# EasyEDA schematic SCH_Hall sensor array_2022-12-20.json
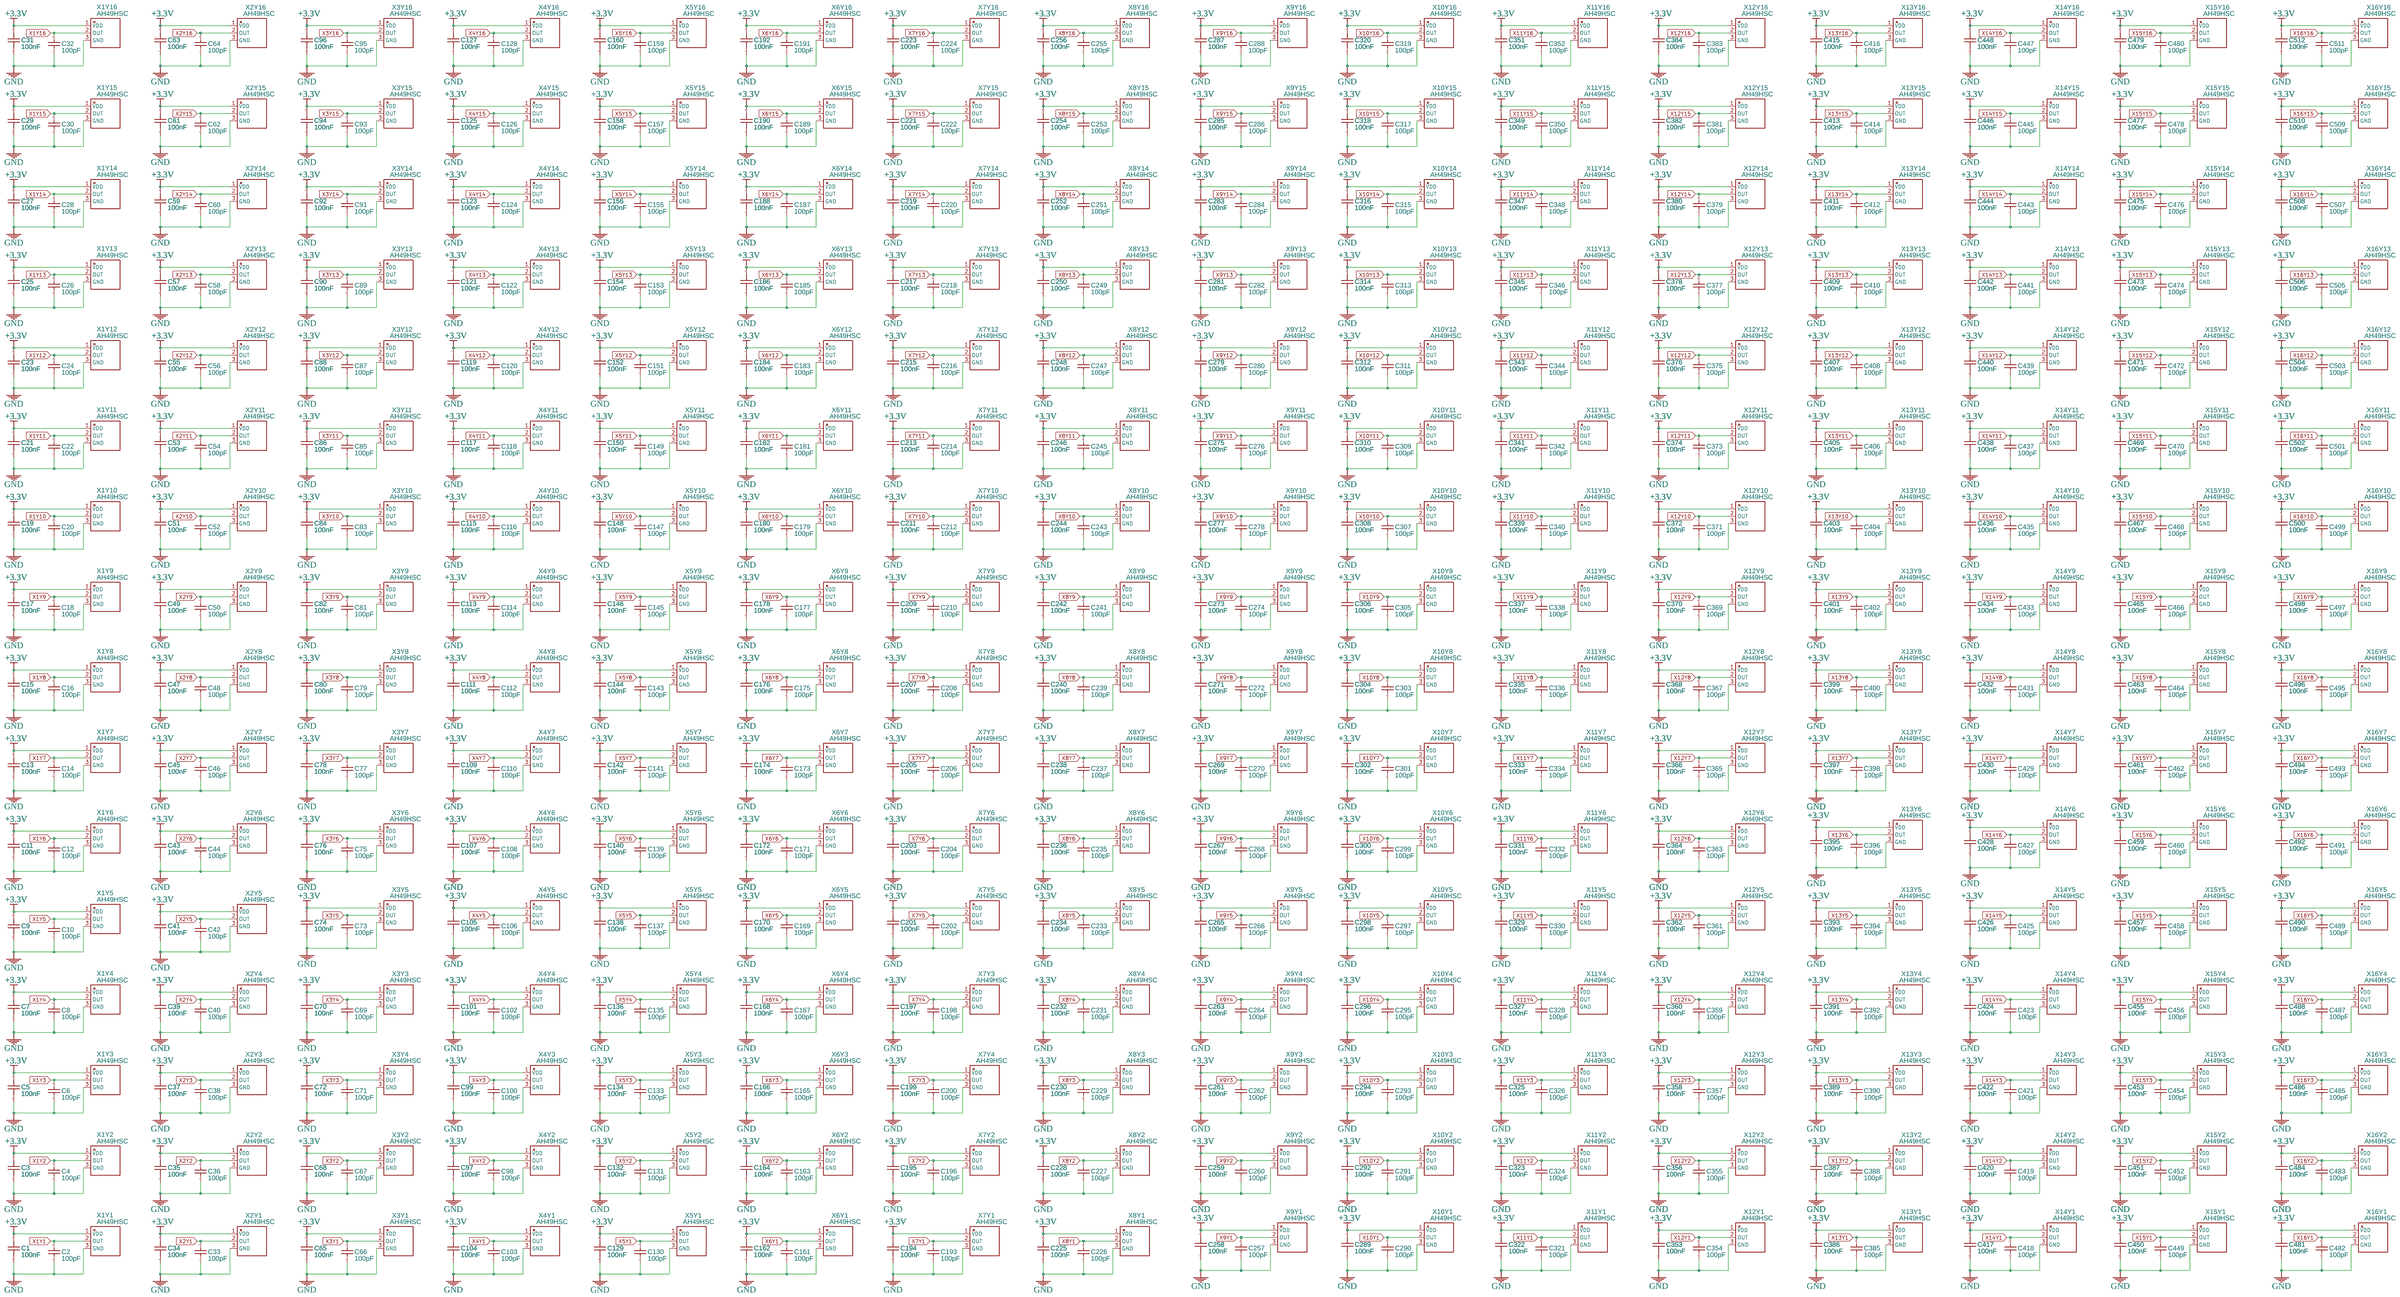
[diagram p0: schematic sheet]

## Parts
C1  100nF  [C0603]
C2  100pF  [C0603]
C3  100nF  [C0603]
C4  100pF  [C0603]
C5  100nF  [C0603]
C6  100pF  [C0603]
C7  100nF  [C0603]
C8  100pF  [C0603]
C9  100nF  [C0603]
C10  100pF  [C0603]
C11  100nF  [C0603]
C12  100pF  [C0603]
C13  100nF  [C0603]
C14  100pF  [C0603]
C15  100nF  [C0603]
C16  100pF  [C0603]
C17  100nF  [C0603]
C18  100pF  [C0603]
C19  100nF  [C0603]
C20  100pF  [C0603]
C21  100nF  [C0603]
C22  100pF  [C0603]
C23  100nF  [C0603]
C24  100pF  [C0603]
C25  100nF  [C0603]
C26  100pF  [C0603]
C27  100nF  [C0603]
C28  100pF  [C0603]
C29  100nF  [C0603]
C30  100pF  [C0603]
C31  100nF  [C0603]
C32  100pF  [C0603]
C33  100pF  [C0603]
C34  100nF  [C0603]
C35  100nF  [C0603]
C36  100pF  [C0603]
C37  100nF  [C0603]
C38  100pF  [C0603]
C39  100nF  [C0603]
C40  100pF  [C0603]
C41  100nF  [C0603]
C42  100pF  [C0603]
C43  100nF  [C0603]
C44  100pF  [C0603]
C45  100nF  [C0603]
C46  100pF  [C0603]
C47  100nF  [C0603]
C48  100pF  [C0603]
C49  100nF  [C0603]
C50  100pF  [C0603]
C51  100nF  [C0603]
C52  100pF  [C0603]
C53  100nF  [C0603]
C54  100pF  [C0603]
C55  100nF  [C0603]
C56  100pF  [C0603]
C57  100nF  [C0603]
C58  100pF  [C0603]
C59  100nF  [C0603]
C60  100pF  [C0603]
C61  100nF  [C0603]
C62  100pF  [C0603]
C63  100nF  [C0603]
C64  100pF  [C0603]
C65  100nF  [C0603]
C66  100pF  [C0603]
C67  100pF  [C0603]
C68  100nF  [C0603]
C69  100pF  [C0603]
C70  100nF  [C0603]
C71  100pF  [C0603]
C72  100nF  [C0603]
C73  100pF  [C0603]
C74  100nF  [C0603]
C75  100pF  [C0603]
C76  100nF  [C0603]
C77  100pF  [C0603]
C78  100nF  [C0603]
C79  100pF  [C0603]
C80  100nF  [C0603]
C81  100pF  [C0603]
C82  100nF  [C0603]
C83  100pF  [C0603]
C84  100nF  [C0603]
C85  100pF  [C0603]
C86  100nF  [C0603]
C87  100pF  [C0603]
C88  100nF  [C0603]
C89  100pF  [C0603]
C90  100nF  [C0603]
C91  100pF  [C0603]
C92  100nF  [C0603]
C93  100pF  [C0603]
C94  100nF  [C0603]
C95  100pF  [C0603]
C96  100nF  [C0603]
C97  100nF  [C0603]
C98  100pF  [C0603]
C99  100nF  [C0603]
C100  100pF  [C0603]
C101  100nF  [C0603]
C102  100pF  [C0603]
C103  100pF  [C0603]
C104  100nF  [C0603]
C105  100nF  [C0603]
C106  100pF  [C0603]
C107  100nF  [C0603]
C108  100pF  [C0603]
C109  100nF  [C0603]
C110  100pF  [C0603]
C111  100nF  [C0603]
C112  100pF  [C0603]
C113  100nF  [C0603]
C114  100pF  [C0603]
C115  100nF  [C0603]
C116  100pF  [C0603]
C117  100nF  [C0603]
C118  100pF  [C0603]
C119  100nF  [C0603]
C120  100pF  [C0603]
C121  100nF  [C0603]
C122  100pF  [C0603]
C123  100nF  [C0603]
C124  100pF  [C0603]
C125  100nF  [C0603]
C126  100pF  [C0603]
C127  100nF  [C0603]
C128  100pF  [C0603]
C129  100nF  [C0603]
C130  100pF  [C0603]
C131  100pF  [C0603]
C132  100nF  [C0603]
C133  100pF  [C0603]
C134  100nF  [C0603]
C135  100pF  [C0603]
C136  100nF  [C0603]
C137  100pF  [C0603]
C138  100nF  [C0603]
C139  100pF  [C0603]
C140  100nF  [C0603]
C141  100pF  [C0603]
C142  100nF  [C0603]
C143  100pF  [C0603]
C144  100nF  [C0603]
C145  100pF  [C0603]
C146  100nF  [C0603]
C147  100pF  [C0603]
C148  100nF  [C0603]
C149  100pF  [C0603]
C150  100nF  [C0603]
C151  100pF  [C0603]
C152  100nF  [C0603]
C153  100pF  [C0603]
C154  100nF  [C0603]
C155  100pF  [C0603]
C156  100nF  [C0603]
C157  100pF  [C0603]
C158  100nF  [C0603]
C159  100pF  [C0603]
C160  100nF  [C0603]
C161  100pF  [C0603]
C162  100nF  [C0603]
C163  100pF  [C0603]
C164  100nF  [C0603]
C165  100pF  [C0603]
C166  100nF  [C0603]
C167  100pF  [C0603]
C168  100nF  [C0603]
C169  100pF  [C0603]
C170  100nF  [C0603]
C171  100pF  [C0603]
C172  100nF  [C0603]
C173  100pF  [C0603]
C174  100nF  [C0603]
C175  100pF  [C0603]
C176  100nF  [C0603]
C177  100pF  [C0603]
C178  100nF  [C0603]
C179  100pF  [C0603]
C180  100nF  [C0603]
C181  100pF  [C0603]
C182  100nF  [C0603]
C183  100pF  [C0603]
C184  100nF  [C0603]
C185  100pF  [C0603]
C186  100nF  [C0603]
C187  100pF  [C0603]
C188  100nF  [C0603]
C189  100pF  [C0603]
C190  100nF  [C0603]
C191  100pF  [C0603]
C192  100nF  [C0603]
C193  100pF  [C0603]
C194  100nF  [C0603]
C195  100nF  [C0603]
C196  100pF  [C0603]
C197  100nF  [C0603]
C198  100pF  [C0603]
C199  100nF  [C0603]
C200  100pF  [C0603]
C201  100nF  [C0603]
C202  100pF  [C0603]
C203  100nF  [C0603]
C204  100pF  [C0603]
C205  100nF  [C0603]
C206  100pF  [C0603]
C207  100nF  [C0603]
C208  100pF  [C0603]
C209  100nF  [C0603]
C210  100pF  [C0603]
C211  100nF  [C0603]
C212  100pF  [C0603]
C213  100nF  [C0603]
C214  100pF  [C0603]
C215  100nF  [C0603]
C216  100pF  [C0603]
C217  100nF  [C0603]
C218  100pF  [C0603]
C219  100nF  [C0603]
C220  100pF  [C0603]
C221  100nF  [C0603]
C222  100pF  [C0603]
C223  100nF  [C0603]
C224  100pF  [C0603]
C225  100nF  [C0603]
C226  100pF  [C0603]
C227  100pF  [C0603]
C228  100nF  [C0603]
C229  100pF  [C0603]
C230  100nF  [C0603]
C231  100pF  [C0603]
C232  100nF  [C0603]
C233  100pF  [C0603]
C234  100nF  [C0603]
C235  100pF  [C0603]
C236  100nF  [C0603]
C237  100pF  [C0603]
C238  100nF  [C0603]
C239  100pF  [C0603]
C240  100nF  [C0603]
C241  100pF  [C0603]
C242  100nF  [C0603]
C243  100pF  [C0603]
C244  100nF  [C0603]
C245  100pF  [C0603]
C246  100nF  [C0603]
C247  100pF  [C0603]
C248  100nF  [C0603]
C249  100pF  [C0603]
C250  100nF  [C0603]
C251  100pF  [C0603]
C252  100nF  [C0603]
C253  100pF  [C0603]
C254  100nF  [C0603]
C255  100pF  [C0603]
C256  100nF  [C0603]
C257  100pF  [C0603]
C258  100nF  [C0603]
C259  100nF  [C0603]
C260  100pF  [C0603]
C261  100nF  [C0603]
C262  100pF  [C0603]
C263  100nF  [C0603]
C264  100pF  [C0603]
C265  100nF  [C0603]
C266  100pF  [C0603]
C267  100nF  [C0603]
C268  100pF  [C0603]
C269  100nF  [C0603]
C270  100pF  [C0603]
C271  100nF  [C0603]
C272  100pF  [C0603]
C273  100nF  [C0603]
C274  100pF  [C0603]
C275  100nF  [C0603]
C276  100pF  [C0603]
C277  100nF  [C0603]
C278  100pF  [C0603]
C279  100nF  [C0603]
C280  100pF  [C0603]
C281  100nF  [C0603]
C282  100pF  [C0603]
C283  100nF  [C0603]
C284  100pF  [C0603]
C285  100nF  [C0603]
C286  100pF  [C0603]
C287  100nF  [C0603]
C288  100pF  [C0603]
C289  100nF  [C0603]
C290  100pF  [C0603]
C291  100pF  [C0603]
C292  100nF  [C0603]
C293  100pF  [C0603]
C294  100nF  [C0603]
C295  100pF  [C0603]
C296  100nF  [C0603]
C297  100pF  [C0603]
C298  100nF  [C0603]
C299  100pF  [C0603]
C300  100nF  [C0603]
C301  100pF  [C0603]
C302  100nF  [C0603]
C303  100pF  [C0603]
C304  100nF  [C0603]
C305  100pF  [C0603]
C306  100nF  [C0603]
C307  100pF  [C0603]
C308  100nF  [C0603]
C309  100pF  [C0603]
C310  100nF  [C0603]
C311  100pF  [C0603]
C312  100nF  [C0603]
C313  100pF  [C0603]
C314  100nF  [C0603]
C315  100pF  [C0603]
C316  100nF  [C0603]
C317  100pF  [C0603]
C318  100nF  [C0603]
C319  100pF  [C0603]
C320  100nF  [C0603]
C321  100pF  [C0603]
C322  100nF  [C0603]
C323  100nF  [C0603]
C324  100pF  [C0603]
C325  100nF  [C0603]
C326  100pF  [C0603]
C327  100nF  [C0603]
C328  100pF  [C0603]
C329  100nF  [C0603]
C330  100pF  [C0603]
C331  100nF  [C0603]
C332  100pF  [C0603]
C333  100nF  [C0603]
C334  100pF  [C0603]
C335  100nF  [C0603]
C336  100pF  [C0603]
C337  100nF  [C0603]
C338  100pF  [C0603]
C339  100nF  [C0603]
C340  100pF  [C0603]
C341  100nF  [C0603]
C342  100pF  [C0603]
C343  100nF  [C0603]
C344  100pF  [C0603]
C345  100nF  [C0603]
C346  100pF  [C0603]
C347  100nF  [C0603]
C348  100pF  [C0603]
C349  100nF  [C0603]
C350  100pF  [C0603]
C351  100nF  [C0603]
C352  100pF  [C0603]
C353  100nF  [C0603]
C354  100pF  [C0603]
C355  100pF  [C0603]
C356  100nF  [C0603]
C357  100pF  [C0603]
C358  100nF  [C0603]
C359  100pF  [C0603]
C360  100nF  [C0603]
C361  100pF  [C0603]
C362  100nF  [C0603]
C363  100pF  [C0603]
C364  100nF  [C0603]
C365  100pF  [C0603]
C366  100nF  [C0603]
C367  100pF  [C0603]
C368  100nF  [C0603]
C369  100pF  [C0603]
C370  100nF  [C0603]
C371  100pF  [C0603]
C372  100nF  [C0603]
C373  100pF  [C0603]
C374  100nF  [C0603]
C375  100pF  [C0603]
C376  100nF  [C0603]
C377  100pF  [C0603]
C378  100nF  [C0603]
C379  100pF  [C0603]
C380  100nF  [C0603]
C381  100pF  [C0603]
C382  100nF  [C0603]
C383  100pF  [C0603]
C384  100nF  [C0603]
C385  100pF  [C0603]
C386  100nF  [C0603]
C387  100nF  [C0603]
C388  100pF  [C0603]
C389  100nF  [C0603]
C390  100pF  [C0603]
C391  100nF  [C0603]
C392  100pF  [C0603]
C393  100nF  [C0603]
C394  100pF  [C0603]
C395  100nF  [C0603]
C396  100pF  [C0603]
C397  100nF  [C0603]
C398  100pF  [C0603]
C399  100nF  [C0603]
C400  100pF  [C0603]
C401  100nF  [C0603]
C402  100pF  [C0603]
C403  100nF  [C0603]
C404  100pF  [C0603]
C405  100nF  [C0603]
C406  100pF  [C0603]
C407  100nF  [C0603]
C408  100pF  [C0603]
C409  100nF  [C0603]
C410  100pF  [C0603]
C411  100nF  [C0603]
C412  100pF  [C0603]
C413  100nF  [C0603]
C414  100pF  [C0603]
C415  100nF  [C0603]
C416  100pF  [C0603]
C417  100nF  [C0603]
C418  100pF  [C0603]
C419  100pF  [C0603]
C420  100nF  [C0603]
C421  100pF  [C0603]
C422  100nF  [C0603]
C423  100pF  [C0603]
C424  100nF  [C0603]
C425  100pF  [C0603]
C426  100nF  [C0603]
C427  100pF  [C0603]
C428  100nF  [C0603]
C429  100pF  [C0603]
C430  100nF  [C0603]
C431  100pF  [C0603]
C432  100nF  [C0603]
C433  100pF  [C0603]
C434  100nF  [C0603]
C435  100pF  [C0603]
C436  100nF  [C0603]
C437  100pF  [C0603]
C438  100nF  [C0603]
C439  100pF  [C0603]
C440  100nF  [C0603]
C441  100pF  [C0603]
C442  100nF  [C0603]
C443  100pF  [C0603]
C444  100nF  [C0603]
C445  100pF  [C0603]
C446  100nF  [C0603]
C447  100pF  [C0603]
C448  100nF  [C0603]
C449  100pF  [C0603]
C450  100nF  [C0603]
C451  100nF  [C0603]
C452  100pF  [C0603]
C453  100nF  [C0603]
C454  100pF  [C0603]
C455  100nF  [C0603]
C456  100pF  [C0603]
C457  100nF  [C0603]
C458  100pF  [C0603]
C459  100nF  [C0603]
C460  100pF  [C0603]
C461  100nF  [C0603]
C462  100pF  [C0603]
C463  100nF  [C0603]
C464  100pF  [C0603]
C465  100nF  [C0603]
C466  100pF  [C0603]
C467  100nF  [C0603]
C468  100pF  [C0603]
C469  100nF  [C0603]
C470  100pF  [C0603]
C471  100nF  [C0603]
C472  100pF  [C0603]
C473  100nF  [C0603]
C474  100pF  [C0603]
C475  100nF  [C0603]
C476  100pF  [C0603]
C477  100nF  [C0603]
C478  100pF  [C0603]
C479  100nF  [C0603]
C480  100pF  [C0603]
C481  100nF  [C0603]
C482  100pF  [C0603]
C483  100pF  [C0603]
C484  100nF  [C0603]
C485  100pF  [C0603]
C486  100nF  [C0603]
C487  100pF  [C0603]
C488  100nF  [C0603]
C489  100pF  [C0603]
C490  100nF  [C0603]
C491  100pF  [C0603]
C492  100nF  [C0603]
C493  100pF  [C0603]
C494  100nF  [C0603]
C495  100pF  [C0603]
C496  100nF  [C0603]
C497  100pF  [C0603]
C498  100nF  [C0603]
C499  100pF  [C0603]
C500  100nF  [C0603]
C501  100pF  [C0603]
C502  100nF  [C0603]
C503  100pF  [C0603]
C504  100nF  [C0603]
C505  100pF  [C0603]
C506  100nF  [C0603]
C507  100pF  [C0603]
C508  100nF  [C0603]
C509  100pF  [C0603]
C510  100nF  [C0603]
C511  100pF  [C0603]
C512  100nF  [C0603]
X1Y1  AH49HSC  [SOT-23-3_L2.9-W1.6-P1.90-LS2.8-BR]
X1Y2  AH49HSC  [SOT-23-3_L2.9-W1.6-P1.90-LS2.8-BR]
X1Y3  AH49HSC  [SOT-23-3_L2.9-W1.6-P1.90-LS2.8-BR]
X1Y4  AH49HSC  [SOT-23-3_L2.9-W1.6-P1.90-LS2.8-BR]
X1Y5  AH49HSC  [SOT-23-3_L2.9-W1.6-P1.90-LS2.8-BR]
X1Y6  AH49HSC  [SOT-23-3_L2.9-W1.6-P1.90-LS2.8-BR]
X1Y7  AH49HSC  [SOT-23-3_L2.9-W1.6-P1.90-LS2.8-BR]
X1Y8  AH49HSC  [SOT-23-3_L2.9-W1.6-P1.90-LS2.8-BR]
X1Y9  AH49HSC  [SOT-23-3_L2.9-W1.6-P1.90-LS2.8-BR]
X1Y10  AH49HSC  [SOT-23-3_L2.9-W1.6-P1.90-LS2.8-BR]
X1Y11  AH49HSC  [SOT-23-3_L2.9-W1.6-P1.90-LS2.8-BR]
X1Y12  AH49HSC  [SOT-23-3_L2.9-W1.6-P1.90-LS2.8-BR]
X1Y13  AH49HSC  [SOT-23-3_L2.9-W1.6-P1.90-LS2.8-BR]
X1Y14  AH49HSC  [SOT-23-3_L2.9-W1.6-P1.90-LS2.8-BR]
X1Y15  AH49HSC  [SOT-23-3_L2.9-W1.6-P1.90-LS2.8-BR]
X1Y16  AH49HSC  [SOT-23-3_L2.9-W1.6-P1.90-LS2.8-BR]
X2Y1  AH49HSC  [SOT-23-3_L2.9-W1.6-P1.90-LS2.8-BR]
X2Y2  AH49HSC  [SOT-23-3_L2.9-W1.6-P1.90-LS2.8-BR]
X2Y3  AH49HSC  [SOT-23-3_L2.9-W1.6-P1.90-LS2.8-BR]
X2Y4  AH49HSC  [SOT-23-3_L2.9-W1.6-P1.90-LS2.8-BR]
X2Y5  AH49HSC  [SOT-23-3_L2.9-W1.6-P1.90-LS2.8-BR]
X2Y6  AH49HSC  [SOT-23-3_L2.9-W1.6-P1.90-LS2.8-BR]
X2Y7  AH49HSC  [SOT-23-3_L2.9-W1.6-P1.90-LS2.8-BR]
X2Y8  AH49HSC  [SOT-23-3_L2.9-W1.6-P1.90-LS2.8-BR]
X2Y9  AH49HSC  [SOT-23-3_L2.9-W1.6-P1.90-LS2.8-BR]
X2Y10  AH49HSC  [SOT-23-3_L2.9-W1.6-P1.90-LS2.8-BR]
X2Y11  AH49HSC  [SOT-23-3_L2.9-W1.6-P1.90-LS2.8-BR]
X2Y12  AH49HSC  [SOT-23-3_L2.9-W1.6-P1.90-LS2.8-BR]
X2Y13  AH49HSC  [SOT-23-3_L2.9-W1.6-P1.90-LS2.8-BR]
X2Y14  AH49HSC  [SOT-23-3_L2.9-W1.6-P1.90-LS2.8-BR]
X2Y15  AH49HSC  [SOT-23-3_L2.9-W1.6-P1.90-LS2.8-BR]
X2Y16  AH49HSC  [SOT-23-3_L2.9-W1.6-P1.90-LS2.8-BR]
X3Y1  AH49HSC  [SOT-23-3_L2.9-W1.6-P1.90-LS2.8-BR]
X3Y2  AH49HSC  [SOT-23-3_L2.9-W1.6-P1.90-LS2.8-BR]
X3Y3  AH49HSC  [SOT-23-3_L2.9-W1.6-P1.90-LS2.8-BR]
X3Y4  AH49HSC  [SOT-23-3_L2.9-W1.6-P1.90-LS2.8-BR]
X3Y5  AH49HSC  [SOT-23-3_L2.9-W1.6-P1.90-LS2.8-BR]
X3Y6  AH49HSC  [SOT-23-3_L2.9-W1.6-P1.90-LS2.8-BR]
X3Y7  AH49HSC  [SOT-23-3_L2.9-W1.6-P1.90-LS2.8-BR]
X3Y8  AH49HSC  [SOT-23-3_L2.9-W1.6-P1.90-LS2.8-BR]
X3Y9  AH49HSC  [SOT-23-3_L2.9-W1.6-P1.90-LS2.8-BR]
X3Y10  AH49HSC  [SOT-23-3_L2.9-W1.6-P1.90-LS2.8-BR]
X3Y11  AH49HSC  [SOT-23-3_L2.9-W1.6-P1.90-LS2.8-BR]
X3Y12  AH49HSC  [SOT-23-3_L2.9-W1.6-P1.90-LS2.8-BR]
X3Y13  AH49HSC  [SOT-23-3_L2.9-W1.6-P1.90-LS2.8-BR]
X3Y14  AH49HSC  [SOT-23-3_L2.9-W1.6-P1.90-LS2.8-BR]
X3Y15  AH49HSC  [SOT-23-3_L2.9-W1.6-P1.90-LS2.8-BR]
X3Y16  AH49HSC  [SOT-23-3_L2.9-W1.6-P1.90-LS2.8-BR]
X4Y1  AH49HSC  [SOT-23-3_L2.9-W1.6-P1.90-LS2.8-BR]
X4Y2  AH49HSC  [SOT-23-3_L2.9-W1.6-P1.90-LS2.8-BR]
X4Y3  AH49HSC  [SOT-23-3_L2.9-W1.6-P1.90-LS2.8-BR]
X4Y4  AH49HSC  [SOT-23-3_L2.9-W1.6-P1.90-LS2.8-BR]
X4Y5  AH49HSC  [SOT-23-3_L2.9-W1.6-P1.90-LS2.8-BR]
X4Y6  AH49HSC  [SOT-23-3_L2.9-W1.6-P1.90-LS2.8-BR]
X4Y7  AH49HSC  [SOT-23-3_L2.9-W1.6-P1.90-LS2.8-BR]
X4Y8  AH49HSC  [SOT-23-3_L2.9-W1.6-P1.90-LS2.8-BR]
X4Y9  AH49HSC  [SOT-23-3_L2.9-W1.6-P1.90-LS2.8-BR]
X4Y10  AH49HSC  [SOT-23-3_L2.9-W1.6-P1.90-LS2.8-BR]
X4Y11  AH49HSC  [SOT-23-3_L2.9-W1.6-P1.90-LS2.8-BR]
X4Y12  AH49HSC  [SOT-23-3_L2.9-W1.6-P1.90-LS2.8-BR]
X4Y13  AH49HSC  [SOT-23-3_L2.9-W1.6-P1.90-LS2.8-BR]
X4Y14  AH49HSC  [SOT-23-3_L2.9-W1.6-P1.90-LS2.8-BR]
X4Y15  AH49HSC  [SOT-23-3_L2.9-W1.6-P1.90-LS2.8-BR]
X4Y16  AH49HSC  [SOT-23-3_L2.9-W1.6-P1.90-LS2.8-BR]
X5Y1  AH49HSC  [SOT-23-3_L2.9-W1.6-P1.90-LS2.8-BR]
X5Y2  AH49HSC  [SOT-23-3_L2.9-W1.6-P1.90-LS2.8-BR]
X5Y3  AH49HSC  [SOT-23-3_L2.9-W1.6-P1.90-LS2.8-BR]
X5Y4  AH49HSC  [SOT-23-3_L2.9-W1.6-P1.90-LS2.8-BR]
X5Y5  AH49HSC  [SOT-23-3_L2.9-W1.6-P1.90-LS2.8-BR]
X5Y6  AH49HSC  [SOT-23-3_L2.9-W1.6-P1.90-LS2.8-BR]
X5Y7  AH49HSC  [SOT-23-3_L2.9-W1.6-P1.90-LS2.8-BR]
X5Y8  AH49HSC  [SOT-23-3_L2.9-W1.6-P1.90-LS2.8-BR]
X5Y9  AH49HSC  [SOT-23-3_L2.9-W1.6-P1.90-LS2.8-BR]
X5Y10  AH49HSC  [SOT-23-3_L2.9-W1.6-P1.90-LS2.8-BR]
X5Y11  AH49HSC  [SOT-23-3_L2.9-W1.6-P1.90-LS2.8-BR]
X5Y12  AH49HSC  [SOT-23-3_L2.9-W1.6-P1.90-LS2.8-BR]
X5Y13  AH49HSC  [SOT-23-3_L2.9-W1.6-P1.90-LS2.8-BR]
X5Y14  AH49HSC  [SOT-23-3_L2.9-W1.6-P1.90-LS2.8-BR]
X5Y15  AH49HSC  [SOT-23-3_L2.9-W1.6-P1.90-LS2.8-BR]
X5Y16  AH49HSC  [SOT-23-3_L2.9-W1.6-P1.90-LS2.8-BR]
X6Y1  AH49HSC  [SOT-23-3_L2.9-W1.6-P1.90-LS2.8-BR]
X6Y2  AH49HSC  [SOT-23-3_L2.9-W1.6-P1.90-LS2.8-BR]
X6Y3  AH49HSC  [SOT-23-3_L2.9-W1.6-P1.90-LS2.8-BR]
X6Y4  AH49HSC  [SOT-23-3_L2.9-W1.6-P1.90-LS2.8-BR]
X6Y5  AH49HSC  [SOT-23-3_L2.9-W1.6-P1.90-LS2.8-BR]
X6Y6  AH49HSC  [SOT-23-3_L2.9-W1.6-P1.90-LS2.8-BR]
X6Y7  AH49HSC  [SOT-23-3_L2.9-W1.6-P1.90-LS2.8-BR]
X6Y8  AH49HSC  [SOT-23-3_L2.9-W1.6-P1.90-LS2.8-BR]
X6Y9  AH49HSC  [SOT-23-3_L2.9-W1.6-P1.90-LS2.8-BR]
X6Y10  AH49HSC  [SOT-23-3_L2.9-W1.6-P1.90-LS2.8-BR]
X6Y11  AH49HSC  [SOT-23-3_L2.9-W1.6-P1.90-LS2.8-BR]
X6Y12  AH49HSC  [SOT-23-3_L2.9-W1.6-P1.90-LS2.8-BR]
X6Y13  AH49HSC  [SOT-23-3_L2.9-W1.6-P1.90-LS2.8-BR]
X6Y14  AH49HSC  [SOT-23-3_L2.9-W1.6-P1.90-LS2.8-BR]
X6Y15  AH49HSC  [SOT-23-3_L2.9-W1.6-P1.90-LS2.8-BR]
X6Y16  AH49HSC  [SOT-23-3_L2.9-W1.6-P1.90-LS2.8-BR]
X7Y1  AH49HSC  [SOT-23-3_L2.9-W1.6-P1.90-LS2.8-BR]
X7Y2  AH49HSC  [SOT-23-3_L2.9-W1.6-P1.90-LS2.8-BR]
X7Y3  AH49HSC  [SOT-23-3_L2.9-W1.6-P1.90-LS2.8-BR]
X7Y4  AH49HSC  [SOT-23-3_L2.9-W1.6-P1.90-LS2.8-BR]
X7Y5  AH49HSC  [SOT-23-3_L2.9-W1.6-P1.90-LS2.8-BR]
X7Y6  AH49HSC  [SOT-23-3_L2.9-W1.6-P1.90-LS2.8-BR]
X7Y7  AH49HSC  [SOT-23-3_L2.9-W1.6-P1.90-LS2.8-BR]
X7Y8  AH49HSC  [SOT-23-3_L2.9-W1.6-P1.90-LS2.8-BR]
X7Y9  AH49HSC  [SOT-23-3_L2.9-W1.6-P1.90-LS2.8-BR]
X7Y10  AH49HSC  [SOT-23-3_L2.9-W1.6-P1.90-LS2.8-BR]
X7Y11  AH49HSC  [SOT-23-3_L2.9-W1.6-P1.90-LS2.8-BR]
X7Y12  AH49HSC  [SOT-23-3_L2.9-W1.6-P1.90-LS2.8-BR]
X7Y13  AH49HSC  [SOT-23-3_L2.9-W1.6-P1.90-LS2.8-BR]
X7Y14  AH49HSC  [SOT-23-3_L2.9-W1.6-P1.90-LS2.8-BR]
X7Y15  AH49HSC  [SOT-23-3_L2.9-W1.6-P1.90-LS2.8-BR]
X7Y16  AH49HSC  [SOT-23-3_L2.9-W1.6-P1.90-LS2.8-BR]
X8Y1  AH49HSC  [SOT-23-3_L2.9-W1.6-P1.90-LS2.8-BR]
X8Y2  AH49HSC  [SOT-23-3_L2.9-W1.6-P1.90-LS2.8-BR]
X8Y3  AH49HSC  [SOT-23-3_L2.9-W1.6-P1.90-LS2.8-BR]
X8Y4  AH49HSC  [SOT-23-3_L2.9-W1.6-P1.90-LS2.8-BR]
X8Y5  AH49HSC  [SOT-23-3_L2.9-W1.6-P1.90-LS2.8-BR]
X8Y6  AH49HSC  [SOT-23-3_L2.9-W1.6-P1.90-LS2.8-BR]
X8Y7  AH49HSC  [SOT-23-3_L2.9-W1.6-P1.90-LS2.8-BR]
X8Y8  AH49HSC  [SOT-23-3_L2.9-W1.6-P1.90-LS2.8-BR]
X8Y9  AH49HSC  [SOT-23-3_L2.9-W1.6-P1.90-LS2.8-BR]
X8Y10  AH49HSC  [SOT-23-3_L2.9-W1.6-P1.90-LS2.8-BR]
X8Y11  AH49HSC  [SOT-23-3_L2.9-W1.6-P1.90-LS2.8-BR]
X8Y12  AH49HSC  [SOT-23-3_L2.9-W1.6-P1.90-LS2.8-BR]
X8Y13  AH49HSC  [SOT-23-3_L2.9-W1.6-P1.90-LS2.8-BR]
X8Y14  AH49HSC  [SOT-23-3_L2.9-W1.6-P1.90-LS2.8-BR]
X8Y15  AH49HSC  [SOT-23-3_L2.9-W1.6-P1.90-LS2.8-BR]
X8Y16  AH49HSC  [SOT-23-3_L2.9-W1.6-P1.90-LS2.8-BR]
X9Y1  AH49HSC  [SOT-23-3_L2.9-W1.6-P1.90-LS2.8-BR]
X9Y2  AH49HSC  [SOT-23-3_L2.9-W1.6-P1.90-LS2.8-BR]
X9Y3  AH49HSC  [SOT-23-3_L2.9-W1.6-P1.90-LS2.8-BR]
X9Y4  AH49HSC  [SOT-23-3_L2.9-W1.6-P1.90-LS2.8-BR]
X9Y5  AH49HSC  [SOT-23-3_L2.9-W1.6-P1.90-LS2.8-BR]
X9Y6  AH49HSC  [SOT-23-3_L2.9-W1.6-P1.90-LS2.8-BR]
X9Y7  AH49HSC  [SOT-23-3_L2.9-W1.6-P1.90-LS2.8-BR]
X9Y8  AH49HSC  [SOT-23-3_L2.9-W1.6-P1.90-LS2.8-BR]
X9Y9  AH49HSC  [SOT-23-3_L2.9-W1.6-P1.90-LS2.8-BR]
X9Y10  AH49HSC  [SOT-23-3_L2.9-W1.6-P1.90-LS2.8-BR]
X9Y11  AH49HSC  [SOT-23-3_L2.9-W1.6-P1.90-LS2.8-BR]
X9Y12  AH49HSC  [SOT-23-3_L2.9-W1.6-P1.90-LS2.8-BR]
X9Y13  AH49HSC  [SOT-23-3_L2.9-W1.6-P1.90-LS2.8-BR]
X9Y14  AH49HSC  [SOT-23-3_L2.9-W1.6-P1.90-LS2.8-BR]
X9Y15  AH49HSC  [SOT-23-3_L2.9-W1.6-P1.90-LS2.8-BR]
X9Y16  AH49HSC  [SOT-23-3_L2.9-W1.6-P1.90-LS2.8-BR]
X10Y1  AH49HSC  [SOT-23-3_L2.9-W1.6-P1.90-LS2.8-BR]
X10Y2  AH49HSC  [SOT-23-3_L2.9-W1.6-P1.90-LS2.8-BR]
X10Y3  AH49HSC  [SOT-23-3_L2.9-W1.6-P1.90-LS2.8-BR]
X10Y4  AH49HSC  [SOT-23-3_L2.9-W1.6-P1.90-LS2.8-BR]
X10Y5  AH49HSC  [SOT-23-3_L2.9-W1.6-P1.90-LS2.8-BR]
X10Y6  AH49HSC  [SOT-23-3_L2.9-W1.6-P1.90-LS2.8-BR]
X10Y7  AH49HSC  [SOT-23-3_L2.9-W1.6-P1.90-LS2.8-BR]
X10Y8  AH49HSC  [SOT-23-3_L2.9-W1.6-P1.90-LS2.8-BR]
X10Y9  AH49HSC  [SOT-23-3_L2.9-W1.6-P1.90-LS2.8-BR]
X10Y10  AH49HSC  [SOT-23-3_L2.9-W1.6-P1.90-LS2.8-BR]
X10Y11  AH49HSC  [SOT-23-3_L2.9-W1.6-P1.90-LS2.8-BR]
X10Y12  AH49HSC  [SOT-23-3_L2.9-W1.6-P1.90-LS2.8-BR]
X10Y13  AH49HSC  [SOT-23-3_L2.9-W1.6-P1.90-LS2.8-BR]
X10Y14  AH49HSC  [SOT-23-3_L2.9-W1.6-P1.90-LS2.8-BR]
X10Y15  AH49HSC  [SOT-23-3_L2.9-W1.6-P1.90-LS2.8-BR]
X10Y16  AH49HSC  [SOT-23-3_L2.9-W1.6-P1.90-LS2.8-BR]
X11Y1  AH49HSC  [SOT-23-3_L2.9-W1.6-P1.90-LS2.8-BR]
X11Y2  AH49HSC  [SOT-23-3_L2.9-W1.6-P1.90-LS2.8-BR]
X11Y3  AH49HSC  [SOT-23-3_L2.9-W1.6-P1.90-LS2.8-BR]
X11Y4  AH49HSC  [SOT-23-3_L2.9-W1.6-P1.90-LS2.8-BR]
X11Y5  AH49HSC  [SOT-23-3_L2.9-W1.6-P1.90-LS2.8-BR]
X11Y6  AH49HSC  [SOT-23-3_L2.9-W1.6-P1.90-LS2.8-BR]
X11Y7  AH49HSC  [SOT-23-3_L2.9-W1.6-P1.90-LS2.8-BR]
X11Y8  AH49HSC  [SOT-23-3_L2.9-W1.6-P1.90-LS2.8-BR]
X11Y9  AH49HSC  [SOT-23-3_L2.9-W1.6-P1.90-LS2.8-BR]
X11Y10  AH49HSC  [SOT-23-3_L2.9-W1.6-P1.90-LS2.8-BR]
X11Y11  AH49HSC  [SOT-23-3_L2.9-W1.6-P1.90-LS2.8-BR]
X11Y12  AH49HSC  [SOT-23-3_L2.9-W1.6-P1.90-LS2.8-BR]
X11Y13  AH49HSC  [SOT-23-3_L2.9-W1.6-P1.90-LS2.8-BR]
X11Y14  AH49HSC  [SOT-23-3_L2.9-W1.6-P1.90-LS2.8-BR]
X11Y15  AH49HSC  [SOT-23-3_L2.9-W1.6-P1.90-LS2.8-BR]
X11Y16  AH49HSC  [SOT-23-3_L2.9-W1.6-P1.90-LS2.8-BR]
X12Y1  AH49HSC  [SOT-23-3_L2.9-W1.6-P1.90-LS2.8-BR]
X12Y2  AH49HSC  [SOT-23-3_L2.9-W1.6-P1.90-LS2.8-BR]
X12Y3  AH49HSC  [SOT-23-3_L2.9-W1.6-P1.90-LS2.8-BR]
X12Y4  AH49HSC  [SOT-23-3_L2.9-W1.6-P1.90-LS2.8-BR]
X12Y5  AH49HSC  [SOT-23-3_L2.9-W1.6-P1.90-LS2.8-BR]
X12Y6  AH49HSC  [SOT-23-3_L2.9-W1.6-P1.90-LS2.8-BR]
X12Y7  AH49HSC  [SOT-23-3_L2.9-W1.6-P1.90-LS2.8-BR]
X12Y8  AH49HSC  [SOT-23-3_L2.9-W1.6-P1.90-LS2.8-BR]
X12Y9  AH49HSC  [SOT-23-3_L2.9-W1.6-P1.90-LS2.8-BR]
X12Y10  AH49HSC  [SOT-23-3_L2.9-W1.6-P1.90-LS2.8-BR]
X12Y11  AH49HSC  [SOT-23-3_L2.9-W1.6-P1.90-LS2.8-BR]
X12Y12  AH49HSC  [SOT-23-3_L2.9-W1.6-P1.90-LS2.8-BR]
X12Y13  AH49HSC  [SOT-23-3_L2.9-W1.6-P1.90-LS2.8-BR]
X12Y14  AH49HSC  [SOT-23-3_L2.9-W1.6-P1.90-LS2.8-BR]
X12Y15  AH49HSC  [SOT-23-3_L2.9-W1.6-P1.90-LS2.8-BR]
X12Y16  AH49HSC  [SOT-23-3_L2.9-W1.6-P1.90-LS2.8-BR]
X13Y1  AH49HSC  [SOT-23-3_L2.9-W1.6-P1.90-LS2.8-BR]
X13Y2  AH49HSC  [SOT-23-3_L2.9-W1.6-P1.90-LS2.8-BR]
X13Y3  AH49HSC  [SOT-23-3_L2.9-W1.6-P1.90-LS2.8-BR]
X13Y4  AH49HSC  [SOT-23-3_L2.9-W1.6-P1.90-LS2.8-BR]
X13Y5  AH49HSC  [SOT-23-3_L2.9-W1.6-P1.90-LS2.8-BR]
X13Y6  AH49HSC  [SOT-23-3_L2.9-W1.6-P1.90-LS2.8-BR]
X13Y7  AH49HSC  [SOT-23-3_L2.9-W1.6-P1.90-LS2.8-BR]
X13Y8  AH49HSC  [SOT-23-3_L2.9-W1.6-P1.90-LS2.8-BR]
X13Y9  AH49HSC  [SOT-23-3_L2.9-W1.6-P1.90-LS2.8-BR]
X13Y10  AH49HSC  [SOT-23-3_L2.9-W1.6-P1.90-LS2.8-BR]
X13Y11  AH49HSC  [SOT-23-3_L2.9-W1.6-P1.90-LS2.8-BR]
X13Y12  AH49HSC  [SOT-23-3_L2.9-W1.6-P1.90-LS2.8-BR]
X13Y13  AH49HSC  [SOT-23-3_L2.9-W1.6-P1.90-LS2.8-BR]
X13Y14  AH49HSC  [SOT-23-3_L2.9-W1.6-P1.90-LS2.8-BR]
X13Y15  AH49HSC  [SOT-23-3_L2.9-W1.6-P1.90-LS2.8-BR]
X13Y16  AH49HSC  [SOT-23-3_L2.9-W1.6-P1.90-LS2.8-BR]
X14Y1  AH49HSC  [SOT-23-3_L2.9-W1.6-P1.90-LS2.8-BR]
X14Y2  AH49HSC  [SOT-23-3_L2.9-W1.6-P1.90-LS2.8-BR]
X14Y3  AH49HSC  [SOT-23-3_L2.9-W1.6-P1.90-LS2.8-BR]
X14Y4  AH49HSC  [SOT-23-3_L2.9-W1.6-P1.90-LS2.8-BR]
X14Y5  AH49HSC  [SOT-23-3_L2.9-W1.6-P1.90-LS2.8-BR]
X14Y6  AH49HSC  [SOT-23-3_L2.9-W1.6-P1.90-LS2.8-BR]
X14Y7  AH49HSC  [SOT-23-3_L2.9-W1.6-P1.90-LS2.8-BR]
X14Y8  AH49HSC  [SOT-23-3_L2.9-W1.6-P1.90-LS2.8-BR]
X14Y9  AH49HSC  [SOT-23-3_L2.9-W1.6-P1.90-LS2.8-BR]
X14Y10  AH49HSC  [SOT-23-3_L2.9-W1.6-P1.90-LS2.8-BR]
X14Y11  AH49HSC  [SOT-23-3_L2.9-W1.6-P1.90-LS2.8-BR]
X14Y12  AH49HSC  [SOT-23-3_L2.9-W1.6-P1.90-LS2.8-BR]
X14Y13  AH49HSC  [SOT-23-3_L2.9-W1.6-P1.90-LS2.8-BR]
X14Y14  AH49HSC  [SOT-23-3_L2.9-W1.6-P1.90-LS2.8-BR]
X14Y15  AH49HSC  [SOT-23-3_L2.9-W1.6-P1.90-LS2.8-BR]
X14Y16  AH49HSC  [SOT-23-3_L2.9-W1.6-P1.90-LS2.8-BR]
X15Y1  AH49HSC  [SOT-23-3_L2.9-W1.6-P1.90-LS2.8-BR]
X15Y2  AH49HSC  [SOT-23-3_L2.9-W1.6-P1.90-LS2.8-BR]
X15Y3  AH49HSC  [SOT-23-3_L2.9-W1.6-P1.90-LS2.8-BR]
X15Y4  AH49HSC  [SOT-23-3_L2.9-W1.6-P1.90-LS2.8-BR]
X15Y5  AH49HSC  [SOT-23-3_L2.9-W1.6-P1.90-LS2.8-BR]
X15Y6  AH49HSC  [SOT-23-3_L2.9-W1.6-P1.90-LS2.8-BR]
X15Y7  AH49HSC  [SOT-23-3_L2.9-W1.6-P1.90-LS2.8-BR]
X15Y8  AH49HSC  [SOT-23-3_L2.9-W1.6-P1.90-LS2.8-BR]
X15Y9  AH49HSC  [SOT-23-3_L2.9-W1.6-P1.90-LS2.8-BR]
X15Y10  AH49HSC  [SOT-23-3_L2.9-W1.6-P1.90-LS2.8-BR]
X15Y11  AH49HSC  [SOT-23-3_L2.9-W1.6-P1.90-LS2.8-BR]
X15Y12  AH49HSC  [SOT-23-3_L2.9-W1.6-P1.90-LS2.8-BR]
X15Y13  AH49HSC  [SOT-23-3_L2.9-W1.6-P1.90-LS2.8-BR]
X15Y14  AH49HSC  [SOT-23-3_L2.9-W1.6-P1.90-LS2.8-BR]
X15Y15  AH49HSC  [SOT-23-3_L2.9-W1.6-P1.90-LS2.8-BR]
X15Y16  AH49HSC  [SOT-23-3_L2.9-W1.6-P1.90-LS2.8-BR]
X16Y1  AH49HSC  [SOT-23-3_L2.9-W1.6-P1.90-LS2.8-BR]
X16Y2  AH49HSC  [SOT-23-3_L2.9-W1.6-P1.90-LS2.8-BR]
X16Y3  AH49HSC  [SOT-23-3_L2.9-W1.6-P1.90-LS2.8-BR]
X16Y4  AH49HSC  [SOT-23-3_L2.9-W1.6-P1.90-LS2.8-BR]
X16Y5  AH49HSC  [SOT-23-3_L2.9-W1.6-P1.90-LS2.8-BR]
X16Y6  AH49HSC  [SOT-23-3_L2.9-W1.6-P1.90-LS2.8-BR]
X16Y7  AH49HSC  [SOT-23-3_L2.9-W1.6-P1.90-LS2.8-BR]
X16Y8  AH49HSC  [SOT-23-3_L2.9-W1.6-P1.90-LS2.8-BR]
X16Y9  AH49HSC  [SOT-23-3_L2.9-W1.6-P1.90-LS2.8-BR]
X16Y10  AH49HSC  [SOT-23-3_L2.9-W1.6-P1.90-LS2.8-BR]
X16Y11  AH49HSC  [SOT-23-3_L2.9-W1.6-P1.90-LS2.8-BR]
X16Y12  AH49HSC  [SOT-23-3_L2.9-W1.6-P1.90-LS2.8-BR]
X16Y13  AH49HSC  [SOT-23-3_L2.9-W1.6-P1.90-LS2.8-BR]
X16Y14  AH49HSC  [SOT-23-3_L2.9-W1.6-P1.90-LS2.8-BR]
X16Y15  AH49HSC  [SOT-23-3_L2.9-W1.6-P1.90-LS2.8-BR]
X16Y16  AH49HSC  [SOT-23-3_L2.9-W1.6-P1.90-LS2.8-BR]

## Library data of the parts
C1 C3 C5 C7 C9 C11 C13 C15 C17 C19 C21 C23 C25 C27 C29 C31 C34 C35 C37 C39 C41 C43 C45 C47 C49 C51 C53 C55 C57 C59 C61 C63 C65 C68 C70 C72 C74 C76 C78 C80 C82 C84 C86 C88 C90 C92 C94 C96 C97 C99 C101 C104 C105 C107 C109 C111 C113 C115 C117 C119 C121 C123 C125 C127 C129 C132 C134 C136 C138 C140 C142 C144 C146 C148 C150 C152 C154 C156 C158 C160 C162 C164 C166 C168 C170 C172 C174 C176 C178 C180 C182 C184 C186 C188 C190 C192 C194 C195 C197 C199 C201 C203 C205 C207 C209 C211 C213 C215 C217 C219 C221 C223 C225 C228 C230 C232 C234 C236 C238 C240 C242 C244 C246 C248 C250 C252 C254 C256 C258 C259 C261 C263 C265 C267 C269 C271 C273 C275 C277 C279 C281 C283 C285 C287 C289 C292 C294 C296 C298 C300 C302 C304 C306 C308 C310 C312 C314 C316 C318 C320 C322 C323 C325 C327 C329 C331 C333 C335 C337 C339 C341 C343 C345 C347 C349 C351 C353 C356 C358 C360 C362 C364 C366 C368 C370 C372 C374 C376 C378 C380 C382 C384 C386 C387 C389 C391 C393 C395 C397 C399 C401 C403 C405 C407 C409 C411 C413 C415 C417 C420 C422 C424 C426 C428 C430 C432 C434 C436 C438 C440 C442 C444 C446 C448 C450 C451 C453 C455 C457 C459 C461 C463 C465 C467 C469 C471 C473 C475 C477 C479 C481 C484 C486 C488 C490 C492 C494 C496 C498 C500 C502 C504 C506 C508 C510 C512 = CL10B104KB8NNNC: Supplier: LCSC; Manufacturer: SAMSUNG(三星); Supplier Part: C1591; JLCPCB Part Class: Extended Part
C2 C4 C6 C8 C10 C12 C14 C16 C18 C20 C22 C24 C26 C28 C30 C32 C33 C36 C38 C40 C42 C44 C46 C48 C50 C52 C54 C56 C58 C60 C62 C64 C66 C67 C69 C71 C73 C75 C77 C79 C81 C83 C85 C87 C89 C91 C93 C95 C98 C100 C102 C103 C106 C108 C110 C112 C114 C116 C118 C120 C122 C124 C126 C128 C130 C131 C133 C135 C137 C139 C141 C143 C145 C147 C149 C151 C153 C155 C157 C159 C161 C163 C165 C167 C169 C171 C173 C175 C177 C179 C181 C183 C185 C187 C189 C191 C193 C196 C198 C200 C202 C204 C206 C208 C210 C212 C214 C216 C218 C220 C222 C224 C226 C227 C229 C231 C233 C235 C237 C239 C241 C243 C245 C247 C249 C251 C253 C255 C257 C260 C262 C264 C266 C268 C270 C272 C274 C276 C278 C280 C282 C284 C286 C288 C290 C291 C293 C295 C297 C299 C301 C303 C305 C307 C309 C311 C313 C315 C317 C319 C321 C324 C326 C328 C330 C332 C334 C336 C338 C340 C342 C344 C346 C348 C350 C352 C354 C355 C357 C359 C361 C363 C365 C367 C369 C371 C373 C375 C377 C379 C381 C383 C385 C388 C390 C392 C394 C396 C398 C400 C402 C404 C406 C408 C410 C412 C414 C416 C418 C419 C421 C423 C425 C427 C429 C431 C433 C435 C437 C439 C441 C443 C445 C447 C449 C452 C454 C456 C458 C460 C462 C464 C466 C468 C470 C472 C474 C476 C478 C480 C482 C483 C485 C487 C489 C491 C493 C495 C497 C499 C501 C503 C505 C507 C509 C511 = CL10C101JB8NNNC: Supplier: LCSC; Manufacturer: SAMSUNG(三星); Supplier Part: C14858; JLCPCB Part Class: Basic Part
X1Y1-X1Y16 X2Y1-X2Y16 X3Y1-X3Y16 X4Y1-X4Y16 X5Y1-X5Y16 X6Y1-X6Y16 X7Y1-X7Y16 X8Y1-X8Y16 X9Y1-X9Y16 X10Y1-X10Y16 X11Y1-X11Y16 X12Y1-X12Y16 X13Y1-X13Y16 X14Y1-X14Y16 X15Y1-X15Y16 X16Y1-X16Y16 = AH49HSC: Supplier: LCSC; Supplier Part: C510723; Manufacturer: PJ(Pingjingsemi); Contributor: LCSC; JLCPCB Part Class: Extended Part

## Nets
+3.3V: C1.2 C3.2 C5.2 C7.2 C9.2 C11.2 C13.2 C15.2 C17.2 C19.2 C21.2 C23.2 C25.2 C27.2 C29.2 C31.2 C34.2 C35.2 C37.2 C39.2 C41.2 C43.2 C45.2 C47.2 C49.2 C51.2 C53.2 C55.2 C57.2 C59.2 C61.2 C63.2 C65.2 C68.2 C70.2 C72.2 C74.2 C76.2 C78.2 C80.2 C82.2 C84.2 C86.2 C88.2 C90.2 C92.2 C94.2 C96.2 C97.2 C99.2 C101.2 C104.2 C105.2 C107.2 C109.2 C111.2 C113.2 C115.2 C117.2 C119.2 C121.2 C123.2 C125.2 C127.2 C129.2 C132.2 C134.2 C136.2 C138.2 C140.2 C142.2 C144.2 C146.2 C148.2 C150.2 C152.2 C154.2 C156.2 C158.2 C160.2 C162.2 C164.2 C166.2 C168.2 C170.2 C172.2 C174.2 C176.2 C178.2 C180.2 C182.2 C184.2 C186.2 C188.2 C190.2 C192.2 C194.2 C195.2 C197.2 C199.2 C201.2 C203.2 C205.2 C207.2 C209.2 C211.2 C213.2 C215.2 C217.2 C219.2 C221.2 C223.2 C225.2 C228.2 C230.2 C232.2 C234.2 C236.2 C238.2 C240.2 C242.2 C244.2 C246.2 C248.2 C250.2 C252.2 C254.2 C256.2 C258.2 C259.2 C261.2 C263.2 C265.2 C267.2 C269.2 C271.2 C273.2 C275.2 C277.2 C279.2 C281.2 C283.2 C285.2 C287.2 C289.2 C292.2 C294.2 C296.2 C298.2 C300.2 C302.2 C304.2 C306.2 C308.2 C310.2 C312.2 C314.2 C316.2 C318.2 C320.2 C322.2 C323.2 C325.2 C327.2 C329.2 C331.2 C333.2 C335.2 C337.2 C339.2 C341.2 C343.2 C345.2 C347.2 C349.2 C351.2 C353.2 C356.2 C358.2 C360.2 C362.2 C364.2 C366.2 C368.2 C370.2 C372.2 C374.2 C376.2 C378.2 C380.2 C382.2 C384.2 C386.2 C387.2 C389.2 C391.2 C393.2 C395.2 C397.2 C399.2 C401.2 C403.2 C405.2 C407.2 C409.2 C411.2 C413.2 C415.2 C417.2 C420.2 C422.2 C424.2 C426.2 C428.2 C430.2 C432.2 C434.2 C436.2 C438.2 C440.2 C442.2 C444.2 C446.2 C448.2 C450.2 C451.2 C453.2 C455.2 C457.2 C459.2 C461.2 C463.2 C465.2 C467.2 C469.2 C471.2 C473.2 C475.2 C477.2 C479.2 C481.2 C484.2 C486.2 C488.2 C490.2 C492.2 C494.2 C496.2 C498.2 C500.2 C502.2 C504.2 C506.2 C508.2 C510.2 C512.2 X1Y1.1(VDD) X1Y2.1(VDD) X1Y3.1(VDD) X1Y4.1(VDD) X1Y5.1(VDD) X1Y6.1(VDD) X1Y7.1(VDD) X1Y8.1(VDD) X1Y9.1(VDD) X1Y10.1(VDD) X1Y11.1(VDD) X1Y12.1(VDD) X1Y13.1(VDD) X1Y14.1(VDD) X1Y15.1(VDD) X1Y16.1(VDD) X2Y1.1(VDD) X2Y2.1(VDD) X2Y3.1(VDD) X2Y4.1(VDD) X2Y5.1(VDD) X2Y6.1(VDD) X2Y7.1(VDD) X2Y8.1(VDD) X2Y9.1(VDD) X2Y10.1(VDD) X2Y11.1(VDD) X2Y12.1(VDD) X2Y13.1(VDD) X2Y14.1(VDD) X2Y15.1(VDD) X2Y16.1(VDD) X3Y1.1(VDD) X3Y2.1(VDD) X3Y3.1(VDD) X3Y4.1(VDD) X3Y5.1(VDD) X3Y6.1(VDD) X3Y7.1(VDD) X3Y8.1(VDD) X3Y9.1(VDD) X3Y10.1(VDD) X3Y11.1(VDD) X3Y12.1(VDD) X3Y13.1(VDD) X3Y14.1(VDD) X3Y15.1(VDD) X3Y16.1(VDD) X4Y1.1(VDD) X4Y2.1(VDD) X4Y3.1(VDD) X4Y4.1(VDD) X4Y5.1(VDD) X4Y6.1(VDD) X4Y7.1(VDD) X4Y8.1(VDD) X4Y9.1(VDD) X4Y10.1(VDD) X4Y11.1(VDD) X4Y12.1(VDD) X4Y13.1(VDD) X4Y14.1(VDD) X4Y15.1(VDD) X4Y16.1(VDD) X5Y1.1(VDD) X5Y2.1(VDD) X5Y3.1(VDD) X5Y4.1(VDD) X5Y5.1(VDD) X5Y6.1(VDD) X5Y7.1(VDD) X5Y8.1(VDD) X5Y9.1(VDD) X5Y10.1(VDD) X5Y11.1(VDD) X5Y12.1(VDD) X5Y13.1(VDD) X5Y14.1(VDD) X5Y15.1(VDD) X5Y16.1(VDD) X6Y1.1(VDD) X6Y2.1(VDD) X6Y3.1(VDD) X6Y4.1(VDD) X6Y5.1(VDD) X6Y6.1(VDD) X6Y7.1(VDD) X6Y8.1(VDD) X6Y9.1(VDD) X6Y10.1(VDD) X6Y11.1(VDD) X6Y12.1(VDD) X6Y13.1(VDD) X6Y14.1(VDD) X6Y15.1(VDD) X6Y16.1(VDD) X7Y1.1(VDD) X7Y2.1(VDD) X7Y3.1(VDD) X7Y4.1(VDD) X7Y5.1(VDD) X7Y6.1(VDD) X7Y7.1(VDD) X7Y8.1(VDD) X7Y9.1(VDD) X7Y10.1(VDD) X7Y11.1(VDD) X7Y12.1(VDD) X7Y13.1(VDD) X7Y14.1(VDD) X7Y15.1(VDD) X7Y16.1(VDD) X8Y1.1(VDD) X8Y2.1(VDD) X8Y3.1(VDD) X8Y4.1(VDD) X8Y5.1(VDD) X8Y6.1(VDD) X8Y7.1(VDD) X8Y8.1(VDD) X8Y9.1(VDD) X8Y10.1(VDD) X8Y11.1(VDD) X8Y12.1(VDD) X8Y13.1(VDD) X8Y14.1(VDD) X8Y15.1(VDD) X8Y16.1(VDD) X9Y1.1(VDD) X9Y2.1(VDD) X9Y3.1(VDD) X9Y4.1(VDD) X9Y5.1(VDD) X9Y6.1(VDD) X9Y7.1(VDD) X9Y8.1(VDD) X9Y9.1(VDD) X9Y10.1(VDD) X9Y11.1(VDD) X9Y12.1(VDD) X9Y13.1(VDD) X9Y14.1(VDD) X9Y15.1(VDD) X9Y16.1(VDD) X10Y1.1(VDD) X10Y2.1(VDD) X10Y3.1(VDD) X10Y4.1(VDD) X10Y5.1(VDD) X10Y6.1(VDD) X10Y7.1(VDD) X10Y8.1(VDD) X10Y9.1(VDD) X10Y10.1(VDD) X10Y11.1(VDD) X10Y12.1(VDD) X10Y13.1(VDD) X10Y14.1(VDD) X10Y15.1(VDD) X10Y16.1(VDD) X11Y1.1(VDD) X11Y2.1(VDD) X11Y3.1(VDD) X11Y4.1(VDD) X11Y5.1(VDD) X11Y6.1(VDD) X11Y7.1(VDD) X11Y8.1(VDD) X11Y9.1(VDD) X11Y10.1(VDD) X11Y11.1(VDD) X11Y12.1(VDD) X11Y13.1(VDD) X11Y14.1(VDD) X11Y15.1(VDD) X11Y16.1(VDD) X12Y1.1(VDD) X12Y2.1(VDD) X12Y3.1(VDD) X12Y4.1(VDD) X12Y5.1(VDD) X12Y6.1(VDD) X12Y7.1(VDD) X12Y8.1(VDD) X12Y9.1(VDD) X12Y10.1(VDD) X12Y11.1(VDD) X12Y12.1(VDD) X12Y13.1(VDD) X12Y14.1(VDD) X12Y15.1(VDD) X12Y16.1(VDD) X13Y1.1(VDD) X13Y2.1(VDD) X13Y3.1(VDD) X13Y4.1(VDD) X13Y5.1(VDD) X13Y6.1(VDD) X13Y7.1(VDD) X13Y8.1(VDD) X13Y9.1(VDD) X13Y10.1(VDD) X13Y11.1(VDD) X13Y12.1(VDD) X13Y13.1(VDD) X13Y14.1(VDD) X13Y15.1(VDD) X13Y16.1(VDD) X14Y1.1(VDD) X14Y2.1(VDD) X14Y3.1(VDD) X14Y4.1(VDD) X14Y5.1(VDD) X14Y6.1(VDD) X14Y7.1(VDD) X14Y8.1(VDD) X14Y9.1(VDD) X14Y10.1(VDD) X14Y11.1(VDD) X14Y12.1(VDD) X14Y13.1(VDD) X14Y14.1(VDD) X14Y15.1(VDD) X14Y16.1(VDD) X15Y1.1(VDD) X15Y2.1(VDD) X15Y3.1(VDD) X15Y4.1(VDD) X15Y5.1(VDD) X15Y6.1(VDD) X15Y7.1(VDD) X15Y8.1(VDD) X15Y9.1(VDD) X15Y10.1(VDD) X15Y11.1(VDD) X15Y12.1(VDD) X15Y13.1(VDD) X15Y14.1(VDD) X15Y15.1(VDD) X15Y16.1(VDD) X16Y1.1(VDD) X16Y2.1(VDD) X16Y3.1(VDD) X16Y4.1(VDD) X16Y5.1(VDD) X16Y6.1(VDD) X16Y7.1(VDD) X16Y8.1(VDD) X16Y9.1(VDD) X16Y10.1(VDD) X16Y11.1(VDD) X16Y12.1(VDD) X16Y13.1(VDD) X16Y14.1(VDD) X16Y15.1(VDD) X16Y16.1(VDD)
GND: C1.1 C2.1 C3.1 C4.1 C5.1 C6.1 C7.1 C8.1 C9.1 C10.1 C11.1 C12.1 C13.1 C14.1 C15.1 C16.1 C17.1 C18.1 C19.1 C20.1 C21.1 C22.1 C23.1 C24.1 C25.1 C26.1 C27.1 C28.1 C29.1 C30.1 C31.1 C32.1 C33.1 C34.1 C35.1 C36.1 C37.1 C38.1 C39.1 C40.1 C41.1 C42.1 C43.1 C44.1 C45.1 C46.1 C47.1 C48.1 C49.1 C50.1 C51.1 C52.1 C53.1 C54.1 C55.1 C56.1 C57.1 C58.1 C59.1 C60.1 C61.1 C62.1 C63.1 C64.1 C65.1 C66.1 C67.1 C68.1 C69.1 C70.1 C71.1 C72.1 C73.1 C74.1 C75.1 C76.1 C77.1 C78.1 C79.1 C80.1 C81.1 C82.1 C83.1 C84.1 C85.1 C86.1 C87.1 C88.1 C89.1 C90.1 C91.1 C92.1 C93.1 C94.1 C95.1 C96.1 C97.1 C98.1 C99.1 C100.1 C101.1 C102.1 C103.1 C104.1 C105.1 C106.1 C107.1 C108.1 C109.1 C110.1 C111.1 C112.1 C113.1 C114.1 C115.1 C116.1 C117.1 C118.1 C119.1 C120.1 C121.1 C122.1 C123.1 C124.1 C125.1 C126.1 C127.1 C128.1 C129.1 C130.1 C131.1 C132.1 C133.1 C134.1 C135.1 C136.1 C137.1 C138.1 C139.1 C140.1 C141.1 C142.1 C143.1 C144.1 C145.1 C146.1 C147.1 C148.1 C149.1 C150.1 C151.1 C152.1 C153.1 C154.1 C155.1 C156.1 C157.1 C158.1 C159.1 C160.1 C161.1 C162.1 C163.1 C164.1 C165.1 C166.1 C167.1 C168.1 C169.1 C170.1 C171.1 C172.1 C173.1 C174.1 C175.1 C176.1 C177.1 C178.1 C179.1 C180.1 C181.1 C182.1 C183.1 C184.1 C185.1 C186.1 C187.1 C188.1 C189.1 C190.1 C191.1 C192.1 C193.1 C194.1 C195.1 C196.1 C197.1 C198.1 C199.1 C200.1 C201.1 C202.1 C203.1 C204.1 C205.1 C206.1 C207.1 C208.1 C209.1 C210.1 C211.1 C212.1 C213.1 C214.1 C215.1 C216.1 C217.1 C218.1 C219.1 C220.1 C221.1 C222.1 C223.1 C224.1 C225.1 C226.1 C227.1 C228.1 C229.1 C230.1 C231.1 C232.1 C233.1 C234.1 C235.1 C236.1 C237.1 C238.1 C239.1 C240.1 C241.1 C242.1 C243.1 C244.1 C245.1 C246.1 C247.1 C248.1 C249.1 C250.1 C251.1 C252.1 C253.1 C254.1 C255.1 C256.1 C257.1 C258.1 C259.1 C260.1 C261.1 C262.1 C263.1 C264.1 C265.1 C266.1 C267.1 C268.1 C269.1 C270.1 C271.1 C272.1 C273.1 C274.1 C275.1 C276.1 C277.1 C278.1 C279.1 C280.1 C281.1 C282.1 C283.1 C284.1 C285.1 C286.1 C287.1 C288.1 C289.1 C290.1 C291.1 C292.1 C293.1 C294.1 C295.1 C296.1 C297.1 C298.1 C299.1 C300.1 C301.1 C302.1 C303.1 C304.1 C305.1 C306.1 C307.1 C308.1 C309.1 C310.1 C311.1 C312.1 C313.1 C314.1 C315.1 C316.1 C317.1 C318.1 C319.1 C320.1 C321.1 C322.1 C323.1 C324.1 C325.1 C326.1 C327.1 C328.1 C329.1 C330.1 C331.1 C332.1 C333.1 C334.1 C335.1 C336.1 C337.1 C338.1 C339.1 C340.1 C341.1 C342.1 C343.1 C344.1 C345.1 C346.1 C347.1 C348.1 C349.1 C350.1 C351.1 C352.1 C353.1 C354.1 C355.1 C356.1 C357.1 C358.1 C359.1 C360.1 C361.1 C362.1 C363.1 C364.1 C365.1 C366.1 C367.1 C368.1 C369.1 C370.1 C371.1 C372.1 C373.1 C374.1 C375.1 C376.1 C377.1 C378.1 C379.1 C380.1 C381.1 C382.1 C383.1 C384.1 C385.1 C386.1 C387.1 C388.1 C389.1 C390.1 C391.1 C392.1 C393.1 C394.1 C395.1 C396.1 C397.1 C398.1 C399.1 C400.1 C401.1 C402.1 C403.1 C404.1 C405.1 C406.1 C407.1 C408.1 C409.1 C410.1 C411.1 C412.1 C413.1 C414.1 C415.1 C416.1 C417.1 C418.1 C419.1 C420.1 C421.1 C422.1 C423.1 C424.1 C425.1 C426.1 C427.1 C428.1 C429.1 C430.1 C431.1 C432.1 C433.1 C434.1 C435.1 C436.1 C437.1 C438.1 C439.1 C440.1 C441.1 C442.1 C443.1 C444.1 C445.1 C446.1 C447.1 C448.1 C449.1 C450.1 C451.1 C452.1 C453.1 C454.1 C455.1 C456.1 C457.1 C458.1 C459.1 C460.1 C461.1 C462.1 C463.1 C464.1 C465.1 C466.1 C467.1 C468.1 C469.1 C470.1 C471.1 C472.1 C473.1 C474.1 C475.1 C476.1 C477.1 C478.1 C479.1 C480.1 C481.1 C482.1 C483.1 C484.1 C485.1 C486.1 C487.1 C488.1 C489.1 C490.1 C491.1 C492.1 C493.1 C494.1 C495.1 C496.1 C497.1 C498.1 C499.1 C500.1 C501.1 C502.1 C503.1 C504.1 C505.1 C506.1 C507.1 C508.1 C509.1 C510.1 C511.1 C512.1 X1Y1.3(GND) X1Y2.3(GND) X1Y3.3(GND) X1Y4.3(GND) X1Y5.3(GND) X1Y6.3(GND) X1Y7.3(GND) X1Y8.3(GND) X1Y9.3(GND) X1Y10.3(GND) X1Y11.3(GND) X1Y12.3(GND) X1Y13.3(GND) X1Y14.3(GND) X1Y15.3(GND) X1Y16.3(GND) X2Y1.3(GND) X2Y2.3(GND) X2Y3.3(GND) X2Y4.3(GND) X2Y5.3(GND) X2Y6.3(GND) X2Y7.3(GND) X2Y8.3(GND) X2Y9.3(GND) X2Y10.3(GND) X2Y11.3(GND) X2Y12.3(GND) X2Y13.3(GND) X2Y14.3(GND) X2Y15.3(GND) X2Y16.3(GND) X3Y1.3(GND) X3Y2.3(GND) X3Y3.3(GND) X3Y4.3(GND) X3Y5.3(GND) X3Y6.3(GND) X3Y7.3(GND) X3Y8.3(GND) X3Y9.3(GND) X3Y10.3(GND) X3Y11.3(GND) X3Y12.3(GND) X3Y13.3(GND) X3Y14.3(GND) X3Y15.3(GND) X3Y16.3(GND) X4Y1.3(GND) X4Y2.3(GND) X4Y3.3(GND) X4Y4.3(GND) X4Y5.3(GND) X4Y6.3(GND) X4Y7.3(GND) X4Y8.3(GND) X4Y9.3(GND) X4Y10.3(GND) X4Y11.3(GND) X4Y12.3(GND) X4Y13.3(GND) X4Y14.3(GND) X4Y15.3(GND) X4Y16.3(GND) X5Y1.3(GND) X5Y2.3(GND) X5Y3.3(GND) X5Y4.3(GND) X5Y5.3(GND) X5Y6.3(GND) X5Y7.3(GND) X5Y8.3(GND) X5Y9.3(GND) X5Y10.3(GND) X5Y11.3(GND) X5Y12.3(GND) X5Y13.3(GND) X5Y14.3(GND) X5Y15.3(GND) X5Y16.3(GND) X6Y1.3(GND) X6Y2.3(GND) X6Y3.3(GND) X6Y4.3(GND) X6Y5.3(GND) X6Y6.3(GND) X6Y7.3(GND) X6Y8.3(GND) X6Y9.3(GND) X6Y10.3(GND) X6Y11.3(GND) X6Y12.3(GND) X6Y13.3(GND) X6Y14.3(GND) X6Y15.3(GND) X6Y16.3(GND) X7Y1.3(GND) X7Y2.3(GND) X7Y3.3(GND) X7Y4.3(GND) X7Y5.3(GND) X7Y6.3(GND) X7Y7.3(GND) X7Y8.3(GND) X7Y9.3(GND) X7Y10.3(GND) X7Y11.3(GND) X7Y12.3(GND) X7Y13.3(GND) X7Y14.3(GND) X7Y15.3(GND) X7Y16.3(GND) X8Y1.3(GND) X8Y2.3(GND) X8Y3.3(GND) X8Y4.3(GND) X8Y5.3(GND) X8Y6.3(GND) X8Y7.3(GND) X8Y8.3(GND) X8Y9.3(GND) X8Y10.3(GND) X8Y11.3(GND) X8Y12.3(GND) X8Y13.3(GND) X8Y14.3(GND) X8Y15.3(GND) X8Y16.3(GND) X9Y1.3(GND) X9Y2.3(GND) X9Y3.3(GND) X9Y4.3(GND) X9Y5.3(GND) X9Y6.3(GND) X9Y7.3(GND) X9Y8.3(GND) X9Y9.3(GND) X9Y10.3(GND) X9Y11.3(GND) X9Y12.3(GND) X9Y13.3(GND) X9Y14.3(GND) X9Y15.3(GND) X9Y16.3(GND) X10Y1.3(GND) X10Y2.3(GND) X10Y3.3(GND) X10Y4.3(GND) X10Y5.3(GND) X10Y6.3(GND) X10Y7.3(GND) X10Y8.3(GND) X10Y9.3(GND) X10Y10.3(GND) X10Y11.3(GND) X10Y12.3(GND) X10Y13.3(GND) X10Y14.3(GND) X10Y15.3(GND) X10Y16.3(GND) X11Y1.3(GND) X11Y2.3(GND) X11Y3.3(GND) X11Y4.3(GND) X11Y5.3(GND) X11Y6.3(GND) X11Y7.3(GND) X11Y8.3(GND) X11Y9.3(GND) X11Y10.3(GND) X11Y11.3(GND) X11Y12.3(GND) X11Y13.3(GND) X11Y14.3(GND) X11Y15.3(GND) X11Y16.3(GND) X12Y1.3(GND) X12Y2.3(GND) X12Y3.3(GND) X12Y4.3(GND) X12Y5.3(GND) X12Y6.3(GND) X12Y7.3(GND) X12Y8.3(GND) X12Y9.3(GND) X12Y10.3(GND) X12Y11.3(GND) X12Y12.3(GND) X12Y13.3(GND) X12Y14.3(GND) X12Y15.3(GND) X12Y16.3(GND) X13Y1.3(GND) X13Y2.3(GND) X13Y3.3(GND) X13Y4.3(GND) X13Y5.3(GND) X13Y6.3(GND) X13Y7.3(GND) X13Y8.3(GND) X13Y9.3(GND) X13Y10.3(GND) X13Y11.3(GND) X13Y12.3(GND) X13Y13.3(GND) X13Y14.3(GND) X13Y15.3(GND) X13Y16.3(GND) X14Y1.3(GND) X14Y2.3(GND) X14Y3.3(GND) X14Y4.3(GND) X14Y5.3(GND) X14Y6.3(GND) X14Y7.3(GND) X14Y8.3(GND) X14Y9.3(GND) X14Y10.3(GND) X14Y11.3(GND) X14Y12.3(GND) X14Y13.3(GND) X14Y14.3(GND) X14Y15.3(GND) X14Y16.3(GND) X15Y1.3(GND) X15Y2.3(GND) X15Y3.3(GND) X15Y4.3(GND) X15Y5.3(GND) X15Y6.3(GND) X15Y7.3(GND) X15Y8.3(GND) X15Y9.3(GND) X15Y10.3(GND) X15Y11.3(GND) X15Y12.3(GND) X15Y13.3(GND) X15Y14.3(GND) X15Y15.3(GND) X15Y16.3(GND) X16Y1.3(GND) X16Y2.3(GND) X16Y3.3(GND) X16Y4.3(GND) X16Y5.3(GND) X16Y6.3(GND) X16Y7.3(GND) X16Y8.3(GND) X16Y9.3(GND) X16Y10.3(GND) X16Y11.3(GND) X16Y12.3(GND) X16Y13.3(GND) X16Y14.3(GND) X16Y15.3(GND) X16Y16.3(GND)
X1Y1: C2.2 X1Y1.2(OUT)
X1Y2: C4.2 X1Y2.2(OUT)
X1Y3: C6.2 X1Y3.2(OUT)
X1Y4: C8.2 X1Y4.2(OUT)
X1Y5: C10.2 X1Y5.2(OUT)
X1Y6: C12.2 X1Y6.2(OUT)
X1Y7: C14.2 X1Y7.2(OUT)
X1Y8: C16.2 X1Y8.2(OUT)
X1Y9: C18.2 X1Y9.2(OUT)
X1Y10: C20.2 X1Y10.2(OUT)
X1Y11: C22.2 X1Y11.2(OUT)
X1Y12: C24.2 X1Y12.2(OUT)
X1Y13: C26.2 X1Y13.2(OUT)
X1Y14: C28.2 X1Y14.2(OUT)
X1Y15: C30.2 X1Y15.2(OUT)
X1Y16: C32.2 X1Y16.2(OUT)
X2Y1: C33.2 X2Y1.2(OUT)
X2Y2: C36.2 X2Y2.2(OUT)
X2Y3: C38.2 X2Y3.2(OUT)
X2Y4: C40.2 X2Y4.2(OUT)
X2Y5: C42.2 X2Y5.2(OUT)
X2Y6: C44.2 X2Y6.2(OUT)
X2Y7: C46.2 X2Y7.2(OUT)
X2Y8: C48.2 X2Y8.2(OUT)
X2Y9: C50.2 X2Y9.2(OUT)
X2Y10: C52.2 X2Y10.2(OUT)
X2Y11: C54.2 X2Y11.2(OUT)
X2Y12: C56.2 X2Y12.2(OUT)
X2Y13: C58.2 X2Y13.2(OUT)
X2Y14: C60.2 X2Y14.2(OUT)
X2Y15: C62.2 X2Y15.2(OUT)
X2Y16: C64.2 X2Y16.2(OUT)
X3Y1: C66.2 X3Y1.2(OUT)
X3Y2: C67.2 X3Y2.2(OUT)
X3Y3: C71.2 X3Y4.2(OUT)
X3Y4: C69.2 X3Y3.2(OUT)
X3Y5: C73.2 X3Y5.2(OUT)
X3Y6: C75.2 X3Y6.2(OUT)
X3Y7: C77.2 X3Y7.2(OUT)
X3Y8: C79.2 X3Y8.2(OUT)
X3Y9: C81.2 X3Y9.2(OUT)
X3Y10: C83.2 X3Y10.2(OUT)
X3Y11: C85.2 X3Y11.2(OUT)
X3Y12: C87.2 X3Y12.2(OUT)
X3Y13: C89.2 X3Y13.2(OUT)
X3Y14: C91.2 X3Y14.2(OUT)
X3Y15: C93.2 X3Y15.2(OUT)
X3Y16: C95.2 X3Y16.2(OUT)
X4Y1: C103.2 X4Y1.2(OUT)
X4Y2: C98.2 X4Y2.2(OUT)
X4Y3: C100.2 X4Y3.2(OUT)
X4Y4: C102.2 X4Y4.2(OUT)
X4Y5: C106.2 X4Y5.2(OUT)
X4Y6: C108.2 X4Y6.2(OUT)
X4Y7: C110.2 X4Y7.2(OUT)
X4Y8: C112.2 X4Y8.2(OUT)
X4Y9: C114.2 X4Y9.2(OUT)
X4Y10: C116.2 X4Y10.2(OUT)
X4Y11: C118.2 X4Y11.2(OUT)
X4Y12: C120.2 X4Y12.2(OUT)
X4Y13: C122.2 X4Y13.2(OUT)
X4Y14: C124.2 X4Y14.2(OUT)
X4Y15: C126.2 X4Y15.2(OUT)
X4Y16: C128.2 X4Y16.2(OUT)
X5Y1: C130.2 X5Y1.2(OUT)
X5Y2: C131.2 X5Y2.2(OUT)
X5Y3: C133.2 X5Y3.2(OUT)
X5Y4: C135.2 X5Y4.2(OUT)
X5Y5: C137.2 X5Y5.2(OUT)
X5Y6: C139.2 X5Y6.2(OUT)
X5Y7: C141.2 X5Y7.2(OUT)
X5Y8: C143.2 X5Y8.2(OUT)
X5Y9: C145.2 X5Y9.2(OUT)
X5Y10: C147.2 X5Y10.2(OUT)
X5Y11: C149.2 X5Y11.2(OUT)
X5Y12: C151.2 X5Y12.2(OUT)
X5Y13: C153.2 X5Y13.2(OUT)
X5Y14: C155.2 X5Y14.2(OUT)
X5Y15: C157.2 X5Y15.2(OUT)
X5Y16: C159.2 X5Y16.2(OUT)
X6Y1: C161.2 X6Y1.2(OUT)
X6Y2: C163.2 X6Y2.2(OUT)
X6Y3: C165.2 X6Y3.2(OUT)
X6Y4: C167.2 X6Y4.2(OUT)
X6Y5: C169.2 X6Y5.2(OUT)
X6Y6: C171.2 X6Y6.2(OUT)
X6Y7: C173.2 X6Y7.2(OUT)
X6Y8: C175.2 X6Y8.2(OUT)
X6Y9: C177.2 X6Y9.2(OUT)
X6Y10: C179.2 X6Y10.2(OUT)
X6Y11: C181.2 X6Y11.2(OUT)
X6Y12: C183.2 X6Y12.2(OUT)
X6Y13: C185.2 X6Y13.2(OUT)
X6Y14: C187.2 X6Y14.2(OUT)
X6Y15: C189.2 X6Y15.2(OUT)
X6Y16: C191.2 X6Y16.2(OUT)
X7Y1: C193.2 X7Y1.2(OUT)
X7Y2: C196.2 X7Y2.2(OUT)
X7Y3: C200.2 X7Y4.2(OUT)
X7Y4: C198.2 X7Y3.2(OUT)
X7Y5: C202.2 X7Y5.2(OUT)
X7Y6: C204.2 X7Y6.2(OUT)
X7Y7: C206.2 X7Y7.2(OUT)
X7Y8: C208.2 X7Y8.2(OUT)
X7Y9: C210.2 X7Y9.2(OUT)
X7Y10: C212.2 X7Y10.2(OUT)
X7Y11: C214.2 X7Y11.2(OUT)
X7Y12: C216.2 X7Y12.2(OUT)
X7Y13: C218.2 X7Y13.2(OUT)
X7Y14: C220.2 X7Y14.2(OUT)
X7Y15: C222.2 X7Y15.2(OUT)
X7Y16: C224.2 X7Y16.2(OUT)
X8Y1: C226.2 X8Y1.2(OUT)
X8Y2: C227.2 X8Y2.2(OUT)
X8Y3: C229.2 X8Y3.2(OUT)
X8Y4: C231.2 X8Y4.2(OUT)
X8Y5: C233.2 X8Y5.2(OUT)
X8Y6: C235.2 X8Y6.2(OUT)
X8Y7: C237.2 X8Y7.2(OUT)
X8Y8: C239.2 X8Y8.2(OUT)
X8Y9: C241.2 X8Y9.2(OUT)
X8Y10: C243.2 X8Y10.2(OUT)
X8Y11: C245.2 X8Y11.2(OUT)
X8Y12: C247.2 X8Y12.2(OUT)
X8Y13: C249.2 X8Y13.2(OUT)
X8Y14: C251.2 X8Y14.2(OUT)
X8Y15: C253.2 X8Y15.2(OUT)
X8Y16: C255.2 X8Y16.2(OUT)
X9Y1: C257.2 X9Y1.2(OUT)
X9Y2: C260.2 X9Y2.2(OUT)
X9Y3: C262.2 X9Y3.2(OUT)
X9Y4: C264.2 X9Y4.2(OUT)
X9Y5: C266.2 X9Y5.2(OUT)
X9Y6: C268.2 X9Y6.2(OUT)
X9Y7: C270.2 X9Y7.2(OUT)
X9Y8: C272.2 X9Y8.2(OUT)
X9Y9: C274.2 X9Y9.2(OUT)
X9Y10: C278.2 X9Y10.2(OUT)
X9Y11: C276.2 X9Y11.2(OUT)
X9Y12: C280.2 X9Y12.2(OUT)
X9Y13: C282.2 X9Y13.2(OUT)
X9Y14: C284.2 X9Y14.2(OUT)
X9Y15: C286.2 X9Y15.2(OUT)
X9Y16: C288.2 X9Y16.2(OUT)
X10Y1: C290.2 X10Y1.2(OUT)
X10Y2: C291.2 X10Y2.2(OUT)
X10Y3: C293.2 X10Y3.2(OUT)
X10Y4: C295.2 X10Y4.2(OUT)
X10Y5: C297.2 X10Y5.2(OUT)
X10Y6: C299.2 X10Y6.2(OUT)
X10Y7: C301.2 X10Y7.2(OUT)
X10Y8: C303.2 X10Y8.2(OUT)
X10Y9: C305.2 X10Y9.2(OUT)
X10Y10: C307.2 X10Y10.2(OUT)
X10Y11: C309.2 X10Y11.2(OUT)
X10Y12: C311.2 X10Y12.2(OUT)
X10Y13: C313.2 X10Y13.2(OUT)
X10Y14: C315.2 X10Y14.2(OUT)
X10Y15: C317.2 X10Y15.2(OUT)
X10Y16: C319.2 X10Y16.2(OUT)
X11Y1: C321.2 X11Y1.2(OUT)
X11Y2: C324.2 X11Y2.2(OUT)
X11Y3: C326.2 X11Y3.2(OUT)
X11Y4: C328.2 X11Y4.2(OUT)
X11Y5: C330.2 X11Y5.2(OUT)
X11Y6: C332.2 X11Y6.2(OUT)
X11Y7: C334.2 X11Y7.2(OUT)
X11Y8: C336.2 X11Y8.2(OUT)
X11Y9: C338.2 X11Y9.2(OUT)
X11Y10: C340.2 X11Y10.2(OUT)
X11Y11: C342.2 X11Y11.2(OUT)
X11Y12: C344.2 X11Y12.2(OUT)
X11Y13: C346.2 X11Y13.2(OUT)
X11Y14: C348.2 X11Y14.2(OUT)
X11Y15: C350.2 X11Y15.2(OUT)
X11Y16: C352.2 X11Y16.2(OUT)
X12Y1: C354.2 X12Y1.2(OUT)
X12Y2: C355.2 X12Y2.2(OUT)
X12Y3: C357.2 X12Y3.2(OUT)
X12Y4: C359.2 X12Y4.2(OUT)
X12Y5: C361.2 X12Y5.2(OUT)
X12Y6: C363.2 X12Y6.2(OUT)
X12Y7: C365.2 X12Y7.2(OUT)
X12Y8: C367.2 X12Y8.2(OUT)
X12Y9: C369.2 X12Y9.2(OUT)
X12Y10: C371.2 X12Y10.2(OUT)
X12Y11: C373.2 X12Y11.2(OUT)
X12Y12: C375.2 X12Y12.2(OUT)
X12Y13: C377.2 X12Y13.2(OUT)
X12Y14: C379.2 X12Y14.2(OUT)
X12Y15: C381.2 X12Y15.2(OUT)
X12Y16: C383.2 X12Y16.2(OUT)
X13Y1: C385.2 X13Y1.2(OUT)
X13Y2: C388.2 X13Y2.2(OUT)
X13Y3: C390.2 X13Y3.2(OUT)
X13Y4: C392.2 X13Y4.2(OUT)
X13Y5: C394.2 X13Y5.2(OUT)
X13Y6: C396.2 X13Y6.2(OUT)
X13Y7: C398.2 X13Y7.2(OUT)
X13Y8: C400.2 X13Y8.2(OUT)
X13Y9: C402.2 X13Y9.2(OUT)
X13Y10: C404.2 X13Y10.2(OUT)
X13Y11: C406.2 X13Y11.2(OUT)
X13Y12: C408.2 X13Y12.2(OUT)
X13Y13: C410.2 X13Y13.2(OUT)
X13Y14: C412.2 X13Y14.2(OUT)
X13Y15: C414.2 X13Y15.2(OUT)
X13Y16: C416.2 X13Y16.2(OUT)
X14Y1: C418.2 X14Y1.2(OUT)
X14Y2: C419.2 X14Y2.2(OUT)
X14Y3: C421.2 X14Y3.2(OUT)
X14Y4: C423.2 X14Y4.2(OUT)
X14Y5: C425.2 X14Y5.2(OUT)
X14Y6: C427.2 X14Y6.2(OUT)
X14Y7: C429.2 X14Y7.2(OUT)
X14Y8: C431.2 X14Y8.2(OUT)
X14Y9: C433.2 X14Y9.2(OUT)
X14Y10: C435.2 X14Y10.2(OUT)
X14Y11: C437.2 X14Y11.2(OUT)
X14Y12: C439.2 X14Y12.2(OUT)
X14Y13: C441.2 X14Y13.2(OUT)
X14Y14: C443.2 X14Y14.2(OUT)
X14Y15: C445.2 X14Y15.2(OUT)
X14Y16: C447.2 X14Y16.2(OUT)
X15Y1: C449.2 X15Y1.2(OUT)
X15Y2: C452.2 X15Y2.2(OUT)
X15Y3: C454.2 X15Y3.2(OUT)
X15Y4: C456.2 X15Y4.2(OUT)
X15Y5: C458.2 X15Y5.2(OUT)
X15Y6: C460.2 X15Y6.2(OUT)
X15Y7: C462.2 X15Y7.2(OUT)
X15Y8: C464.2 X15Y8.2(OUT)
X15Y9: C466.2 X15Y9.2(OUT)
X15Y10: C468.2 X15Y10.2(OUT)
X15Y11: C470.2 X15Y11.2(OUT)
X15Y12: C472.2 X15Y12.2(OUT)
X15Y13: C474.2 X15Y13.2(OUT)
X15Y14: C476.2 X15Y14.2(OUT)
X15Y15: C478.2 X15Y15.2(OUT)
X15Y16: C480.2 X15Y16.2(OUT)
X16Y1: C482.2 X16Y1.2(OUT)
X16Y2: C483.2 X16Y2.2(OUT)
X16Y3: C485.2 X16Y3.2(OUT)
X16Y4: C487.2 X16Y4.2(OUT)
X16Y5: C489.2 X16Y5.2(OUT)
X16Y6: C491.2 X16Y6.2(OUT)
X16Y7: C493.2 X16Y7.2(OUT)
X16Y8: C495.2 X16Y8.2(OUT)
X16Y9: C497.2 X16Y9.2(OUT)
X16Y10: C499.2 X16Y10.2(OUT)
X16Y11: C501.2 X16Y11.2(OUT)
X16Y12: C503.2 X16Y12.2(OUT)
X16Y13: C505.2 X16Y13.2(OUT)
X16Y14: C507.2 X16Y14.2(OUT)
X16Y15: C509.2 X16Y15.2(OUT)
X16Y16: C511.2 X16Y16.2(OUT)
